# Altium project ChillerLCD.PrjPCB
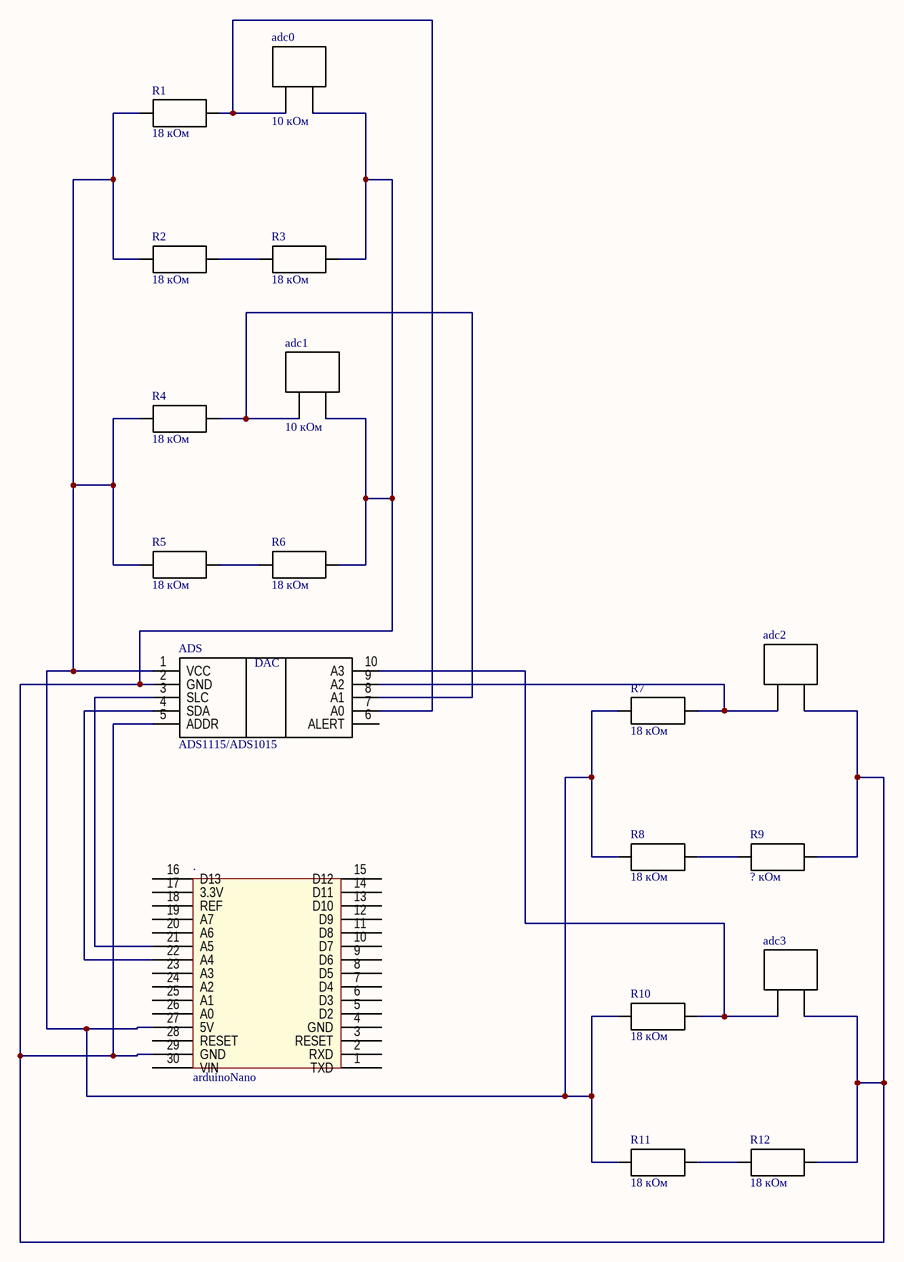
[diagram p0: ChillerLCD.SchDoc]
1 sheet, 18 parts. Net scope: global (net labels, ports and power ports of the same name join across sheets).
Board file: ChillerLCD.PcbDoc

## Sheet ChillerLCD.SchDoc
size 420 x 297 mm; Address1: Address1; Address2: Address2; Address3: Address3; Address4: Address4; DocumentNumber: Chiller; SheetNumber: 1; Scale: 1:1; DocumentType: Схема электрическая принципиальная; FirstReferrence: АБВГ.123456.001

### Parts
.  arduinoNano  [Arduino Nano]
adc0  Ом: 10 кОм  [CWF-2 2.5mm]  (hidden comment: Termoresistor)
adc1  Ом: 10 кОм  [CWF-2 2.5mm]  (hidden comment: Termoresistor)
adc2  Pt Resistor  [CWF-2 2.5mm]  (value not drawn)
adc3  Pt Resistor  [CWF-2 2.5mm]  (value not drawn)
ADS  ADS1115/ADS1015  [ADS1115/ADS1015]
R1  Ом: 18 кОм  [3216[1206]]  (hidden comment: Res1206)
R2  Ом: 18 кОм  [3216[1206]]  (hidden comment: Res1206)
R3  Ом: 18 кОм  [3216[1206]]  (hidden comment: Res1206)
R4  Ом: 18 кОм  [3216[1206]]  (hidden comment: Res1206)
R5  Ом: 18 кОм  [3216[1206]]  (hidden comment: Res1206)
R6  Ом: 18 кОм  [3216[1206]]  (hidden comment: Res1206)
R7  Ом: 18 кОм  [3216[1206]]  (hidden comment: Res1206)
R8  Ом: 18 кОм  [3216[1206]]  (hidden comment: Res1206)
R9  Ом: ? кОм  [3216[1206]]  (hidden comment: Res1206)
R10  Ом: 18 кОм  [3216[1206]]  (hidden comment: Res1206)
R11  Ом: 18 кОм  [3216[1206]]  (hidden comment: Res1206)
R12  Ом: 18 кОм  [3216[1206]]  (hidden comment: Res1206)

### Nets
Net._21: ..21(A5) ADS.3(SLC)
Net._22: ..22(A4) ADS.4(SDA)
Net._27: ..27(5V) ADS.1(VCC) R1.1 R2.1 R4.1 R5.1 R7.1 R8.1 R10.1 R11.1
Net._29: ..29(GND) adc0.2 adc1.2 adc2.2 adc3.2 ADS.2(GND) ADS.5(ADDR) R3.2 R6.2 R9.2 R12.2
Netadc0_1: adc0.1 ADS.7(A0) R1.2
Netadc1_1: adc1.1 ADS.8(A1) R4.2
Netadc2_1: adc2.1 ADS.9(A2) R7.2
Netadc3_1: adc3.1 ADS.10(A3) R10.2
NetR2_2: R2.2 R3.1
NetR5_2: R5.2 R6.1
NetR8_2: R8.2 R9.1
NetR11_2: R11.2 R12.1

Not connected (* = marked no-connect by the designer): . 1(TXD) 2(RXD) 3(RESET) 4(GND) 5(D2) 6(D3) 7(D4) 8(D5) 9(D6) 10(D7) 11(D8) 12(D9) 13(D10) 14(D11) 15(D12) 16(D13) 17(3.3V) 18(REF) 19(A7) 20(A6) 23(A3) 24(A2) 25(A1) 26(A0) 28(RESET) 30(VIN); ADS 6(ALERT)

### Notes on the sheet
- Перв. примен.
- Справ. №
- Подп. и дата
- Инв. № дубл.
- Взам. инв. №
- Разраб.
- Изм.
- Лист
- № докум.
- Подп.
- Дата
- Лит.
- Масса
- Масштаб
- Пров.
- Т.контр.
- Листов
- Инв. № подл.
- Утв.
- Н.контр.
- 2.106-A3
- Копировал
- Формат А3
- (in symbol ADS1115/ADS1015) DAC